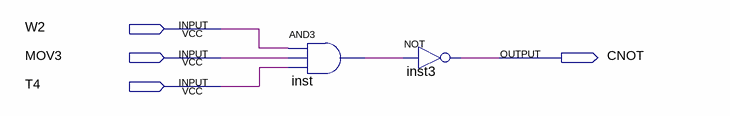
[diagram p0: schematic sheet]
// Quartus schematic CNOT.bdf as structural Verilog: 2 symbols, 4 pins
module CNOT (
  input  W2,
  input  MOV3,
  input  T4,
  output CNOT
);

  wire inst_out;

  and inst (inst_out, W2, MOV3, T4);
  not inst3 (CNOT, inst_out);
endmodule
